# EAGLE design design (EAGLE 7.3.0)
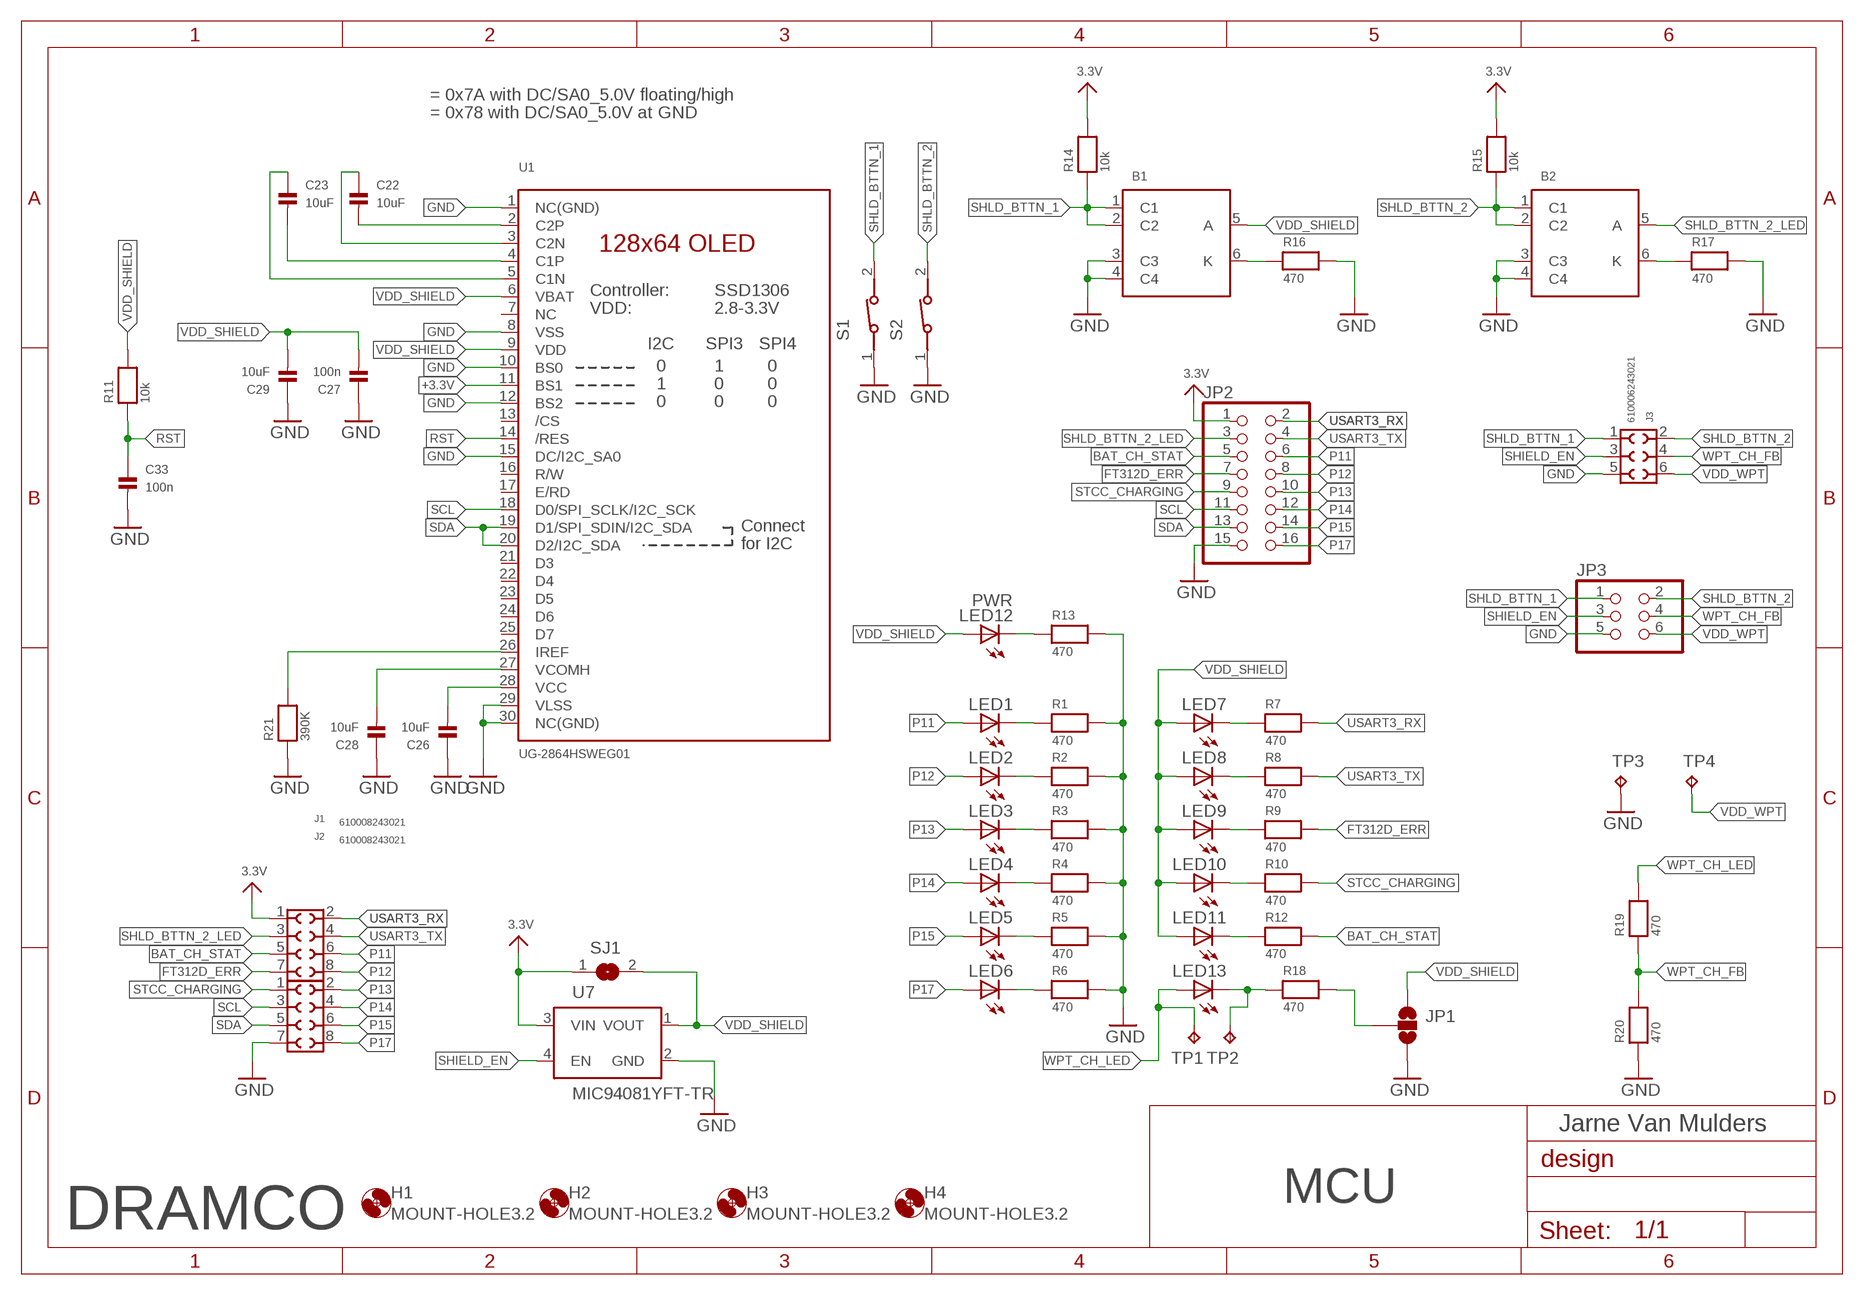
[diagram p0: schematic, sheet 1]

## Parts
B1  TS121273  [TS121273]
B2  TS121273  [TS121273]
C22  10uF  CAP_CERAMIC0805  [0805]
C23  10uF  CAP_CERAMIC0805  [0805]
C26  10uF  CAP_CERAMIC0805  [0805]
C27  100n  CAP_CERAMIC0603  [0603]
C28  10uF  CAP_CERAMIC0805  [0805]
C29  10uF  CAP_CERAMIC0805  [0805]
C33  100n  CAP_CERAMIC0603  [0603]
H1  MOUNT-HOLE3.2  [3,2]
H2  MOUNT-HOLE3.2  [3,2]
H3  MOUNT-HOLE3.2  [3,2]
H4  MOUNT-HOLE3.2  [3,2]
J1  610008243021  6100XX243021_610008243021  [610008243021]
J2  610008243021  6100XX243021_610008243021  [610008243021]
J3  610006243021  6100XX243021_610006243021  [610006243021]
JP1  JUMPER-SMT_3_NO_NO-SILK  [SMT-JUMPER_3_NO_NO-SILK]
JP2  HEADER-2X8  [2X08]
JP3  HEADER-2X3  [2X03_ROUND_70MIL]
LED1  LED3MM  [LED3MM]
LED2  LED3MM  [LED3MM]
LED3  LED3MM  [LED3MM]
LED4  LED3MM  [LED3MM]
LED5  LED3MM  [LED3MM]
LED6  LED3MM  [LED3MM]
LED7  LED3MM  [LED3MM]
LED8  LED3MM  [LED3MM]
LED9  LED3MM  [LED3MM]
LED10  LED3MM  [LED3MM]
LED11  LED3MM  [LED3MM]
LED12  PWR  LED3MM  [LED3MM]
LED13  LED3MM  [LED3MM]
R1  470  RESISTOR0603  [0603]
R2  470  RESISTOR0603  [0603]
R3  470  RESISTOR0603  [0603]
R4  470  RESISTOR0603  [0603]
R5  470  RESISTOR0603  [0603]
R6  470  RESISTOR0603  [0603]
R7  470  RESISTOR0603  [0603]
R8  470  RESISTOR0603  [0603]
R9  470  RESISTOR0603  [0603]
R10  470  RESISTOR0603  [0603]
R11  10k  RESISTOR0805  [0805]
R12  470  RESISTOR0603  [0603]
R13  470  RESISTOR0603  [0603]
R14  10k  RESISTOR0603  [0603]
R15  10k  RESISTOR0603  [0603]
R16  470  RESISTOR0603  [0603]
R17  470  RESISTOR0603  [0603]
R18  470  RESISTOR0603  [0603]
R19  470  RESISTOR0603  [0603]
R20  470  RESISTOR0603  [0603]
R21  390K  RESISTOR0805  [0805]
S1  434111043826  [434111043826]
S2  434111043826  [434111043826]
SJ1  SOLDERJUMPERREFLOW  [SOLDERJUMPER_REFLOW]
TP1  TPTP20SQ  [TP20SQ]
TP2  TPTP20SQ  [TP20SQ]
TP3  TPTP20SQ  [TP20SQ]
TP4  TPTP20SQ  [TP20SQ]
U1  UG-2864HSWEG01  DISP_OLED_UG-2864HSWEG010.96"  [UG-2864HSWEG01_0.96IN_WRAPAROUND]
U7  MIC94081YFT-TR  [IC_MIC94081YFT-TR]

## Nets
3.3V: J2.1 JP2.1 R14.2 R15.2 SJ1.1 U7.3(VIN)
+3.3V: U1.11(BS1)
BAT_CH_STAT: J2.5 JP2.5 R12.2
FT312D_ERR: J2.7 JP2.7 R9.2
GND: B1.3(C3) B1.4(C4) B2.3(C3) B2.4(C4) C26.1 C27.1 C28.1 C29.1 C33.2 J1.7 J3.5 JP1.3 JP2.15 JP3.5 R1.2 R2.2 R3.2 R4.2 R5.2 R6.2 R13.2 R16.2 R17.2 R20.1 R21.1 S1.1 S2.1 TP3.TP U1.1(NC(GND)) U1.8(VSS) U1.10(BS0) U1.12(BS2) U1.15(DC/I2C_SA0) U1.29(VLSS) U1.30(NC(GND)) U7.2(GND)
N$1: LED6.K(C) R6.1
N$3: LED5.K(C) R5.1
N$4: LED4.K(C) R4.1
N$5: LED3.K(C) R3.1
N$6: LED2.K(C) R2.1
N$7: LED1.K(C) R1.1
N$8: LED7.K(C) R7.1
N$9: LED8.K(C) R8.1
N$10: LED9.K(C) R9.1
N$11: C22.2 U1.2(C2P)
N$12: LED10.K(C) R10.1
N$13: LED11.K(C) R12.1
N$14: LED12.K(C) R13.1
N$15: B1.6(K) R16.1
N$16: C26.2 U1.28(VCC)
N$17: B2.6(K) R17.1
N$18: JP1.2 R18.2
N$19: C28.2 U1.27(VCOMH)
N$20: LED13.K(C) R18.1 TP2.TP
N$104: R21.2 U1.26(IREF)
N$112: C22.1 U1.3(C2N)
N$113: C23.2 U1.4(C1P)
N$114: C23.1 U1.5(C1N)
P11: J2.6 JP2.6 LED1.A
P12: J2.8 JP2.8 LED2.A
P13: J1.2 JP2.10 LED3.A
P14: J1.4 JP2.12 LED4.A
P15: J1.6 JP2.14 LED5.A
P17: J1.8 JP2.16 LED6.A
RST: C33.1 R11.1 U1.14(/RES)
SCL: J1.3 JP2.11 U1.18(D0/SPI_SCLK/I2C_SCK)
SDA: J1.5 JP2.13 U1.19(D1/SPI_SDIN/I2C_SDA) U1.20(D2/I2C_SDA)
SHIELD_EN: J3.3 JP3.3 U7.4(EN)
SHLD_BTTN_1: B1.1(C1) B1.2(C2) J3.1 JP3.1 R14.1 S1.2
SHLD_BTTN_2: B2.1(C1) B2.2(C2) J3.2 JP3.2 R15.1 S2.2
SHLD_BTTN_2_LED: B2.5(A) J2.3 JP2.3
STCC_CHARGING: J1.1 JP2.9 R10.2
USART3_RX: J2.2 JP2.2 R7.2
USART3_TX: J2.4 JP2.4 R8.2
VDD_SHIELD: B1.5(A) C27.2 C29.2 JP1.1 LED7.A LED8.A LED9.A LED10.A LED11.A LED12.A R11.2 SJ1.2 U1.6(VBAT) U1.9(VDD) U7.1(VOUT)
VDD_WPT: J3.6 JP3.6 TP4.TP
WPT_CH_FB: J3.4 JP3.4 R19.1 R20.2
WPT_CH_LED: LED13.A R19.2 TP1.TP
Unconnected: U1.7(NC) U1.13(/CS) U1.16(R/W) U1.17(E/RD) U1.21(D3) U1.22(D4) U1.23(D5) U1.24(D6) U1.25(D7)

## Notes on the sheet
- = 0x7A with DC/SA0_5.0V floating/high
- = 0x78 with DC/SA0_5.0V at GND
- Jarne Van Mulders
- MCU
- DRAMCO

## Library data of the parts
B1 B2 = TS121273:TS121273
C22 C23 C26-C29 C33 = microbuilder:CAP_CERAMIC: Ceramic Capacitors 0402 - 0402 Surface Mount Capacitors 16pF 50V 5% [Digikey: 445-4899-2-ND] 18pF 50V 5% [Digikey: 490-1281-2-ND] 22pF 50V 5% [Digikey: 490-1283-2-ND] 68pF 50V 5% [Digikey: 490-1289-2-ND] 0.1uF 10V 10% [Digikey: 490-1318-2-ND] 1.0uF 6.3V 10% [Digikey: 490-1320-2-ND] 0603 - 0603 Surface Mount Capacitors 16 pF 50V 5% [Digikey: 445-5051-2-ND] 22 pF 50V [Digikey: PCC220ACVTR-ND] 33 pF 50V 5% [Digikey: 490-1415-1-ND] 56pF 50V 5% [Digikey: 490-1421-1-ND] 220pF 50V 5% [Digikey: 445-1285-1-ND] 680 pF 50V 2200 pF 50V 5% C0G [Digikey: 445-1297-1-ND] 5600 pF 100V 5% X7R [Digikey: 478-3711-1-ND] 0.1 µF 25V 10% [Digikey: PCC2277TR-ND] 0.22 µF 16V 10% X7R [Digikey: 445-1318-1-ND] 1.0 µF 25V 10% [Digikey: 445-5146-2-ND] 0603 - RF Specific 3pF 250V +/-0.1pF RF [Digikey: 712-1347-1-ND] 18 pF 250V 5% [Digikey: 478-3505-1-ND or 712-1322-1-ND] 56 pF 250V 5% C0G RF [Digikey: 490-4867-1-ND] 68 pF 250V RF [Digikey: 490-4868-1-ND] 0805 - 0805 Surface Mount Capacitors 220 pF 250V 2% RF Ceramic Capacitor [Digikey: 712-1398-1-ND] 1000 pF 50V 2% NP0 Ceramic Capacitor [Digikey: 478-3760-1-ND] 0.1 µF 25V 10% Ceramic Capacitor [Digikey: PCC1828TR-ND] 1.0 µF 16V 10% Ceramic Capacitor[Digikey: 490-1691-2-ND] 10.0 µF 10V 10% Ceramic Capacitor[Digikey: 709-1228-1-ND] 10.0 uF 16V 10% Ceramic Capacitor [Digikey: 478-5165-2-ND] 47 uF 6.3V 20% Ceramic Capacitor [Digikey: 587-1779-1-ND or 399-5506-1-ND] 1206 - 1206 Surface Mount Capacitors 47uF 10V 20% Ceramic Capacitor [Digikey: 490-5528-1-ND or 399-5508-1-ND or 445-6010-1-ND] 100uF 6.3V -20%, +80% Y5V Ceramic Capacitor (Digikey: 490-4512-1-ND, Mouser: 81-GRM31CF50J107ZE1L)
H1-H4 = holes:MOUNT-HOLE: MOUNTING HOLE with drill center marker
J1 J2 = WR-PHD_Rev21a:6100XX243021_610008243021: WR-PHD 2.54 mm SMT Dual Socket Header Bottom Entry ARTICLE PROPERTIES: Pins:4;​ 6;​ 8;​ 10;​ 12;​ 16;​ 18;​ 20;​ 22;​ 24;​ 26;​ 32;​ 34 KIND PROPERTIES: Pitch：2.54 mm Quality Class:3 as per CECC 75 301-802 Rows：Dual Gender：Socket Header Type：Bottom Entry Large MATERIAL PROPERTIES: Insulator Material :PA6T Insulator Flammability Rating:UL94 V-0 Contact Material:Copper Alloy Contact Plating:Gold Contact Type:Stamped GENERAL INFORMATION Operating Temperature:-40 up to +125 °C Compliance:Lead free / RoHS ELECTRICAL PROPERTIES: Rated Current:3 A IR 1:3 A Withstanding Voltage:500 V (AC) Contact Resistance:20 mΩ RISO:1000 MΩ CERTIFICATION UL Approval:E323964 PACKAGING PROPERTIES Packaging:Tube <https://katalog.we-online.com/media/images/v2/o33207v209%20Family_WR-PHD_610xxx243021.jpg> Details see: https://katalog.we-online.com/en/em/PHD_2_54_SMT_DUAL_SOCKET_HEADER_BOTTOM_ENTRY_6100XX243021 Updated by Yingchun,Shan 2019-10-23 2019 (C) Würth Elektronik; DATASHEET-URL: https://www.we-online.com/catalog/datasheet/610008243021.pdf; GENDER: Socket Header; IR: 3A; MOUNT: SMT; PACKAGING: Tube; PART-NUMBER: 610008243021; PINS: 8; PITCH: 2.54mm; ROWS: Dual; TYPE: Bottom Entry Large
J3 = WR-PHD_Rev21a:6100XX243021_610006243021: WR-PHD 2.54 mm SMT Dual Socket Header Bottom Entry ARTICLE PROPERTIES: Pins:4;​ 6;​ 8;​ 10;​ 12;​ 16;​ 18;​ 20;​ 22;​ 24;​ 26;​ 32;​ 34 KIND PROPERTIES: Pitch：2.54 mm Quality Class:3 as per CECC 75 301-802 Rows：Dual Gender：Socket Header Type：Bottom Entry Large MATERIAL PROPERTIES: Insulator Material :PA6T Insulator Flammability Rating:UL94 V-0 Contact Material:Copper Alloy Contact Plating:Gold Contact Type:Stamped GENERAL INFORMATION Operating Temperature:-40 up to +125 °C Compliance:Lead free / RoHS ELECTRICAL PROPERTIES: Rated Current:3 A IR 1:3 A Withstanding Voltage:500 V (AC) Contact Resistance:20 mΩ RISO:1000 MΩ CERTIFICATION UL Approval:E323964 PACKAGING PROPERTIES Packaging:Tube <https://katalog.we-online.com/media/images/v2/o33207v209%20Family_WR-PHD_610xxx243021.jpg> Details see: https://katalog.we-online.com/en/em/PHD_2_54_SMT_DUAL_SOCKET_HEADER_BOTTOM_ENTRY_6100XX243021 Updated by Yingchun,Shan 2019-10-23 2019 (C) Würth Elektronik; DATASHEET-URL: https://www.we-online.com/catalog/datasheet/610006243021.pdf; GENDER: Socket Header; IR: 3A; MOUNT: SMT; PACKAGING: Tube; PART-NUMBER: 610006243021; PINS: 6; PITCH: 2.54mm; ROWS: Dual; TYPE: Bottom Entry Large
JP1 = SparkFun-Jumpers:JUMPER-SMT_3_NO: Normally open jumper This jumper has three pads in close proximity to each other. Apply solder to close the connection(s).
JP2 = microbuilder:HEADER-2X8
JP3 = microbuilder:HEADER-2X3: PIN HEADER
LED1-LED13 = adafruit:LED: LED OSRAM: - CHIPLED LG R971, LG N971, LY N971, LG Q971, LY Q971, LO R971, LY R971 LH N974, LH R974 LS Q976, LO Q976, LY Q976 LO Q996 - Hyper CHIPLED LW Q18S LB Q993, LB Q99A, LB R99A - SideLED LS A670, LO A670, LY A670, LG A670, LP A670 LB A673, LV A673, LT A673, LW A673 LH A674 LY A675 LS A676, LA A676, LO A676, LY A676, LW A676 LS A679, LY A679, LG A679 - Hyper Micro SIDELED® LS Y876, LA Y876, LO Y876, LY Y876 LT Y87S - SmartLED LW L88C, LW L88S LB L89C, LB L89S, LG L890 LS L89K, LO L89K, LY L89K LS L896, LA L896, LO L896, LY L896 - TOPLED LS T670, LO T670, LY T670, LG T670, LP T670 LSG T670, LSP T670, LSY T670, LOP T670, LYG T670 LG T671, LOG T671, LSG T671 LB T673, LV T673, LT T673, LW T673 LH T674 LS T676, LA T676, LO T676, LY T676, LB T676, LH T676, LSB T676, LW T676 LB T67C, LV T67C, LT T67C, LS T67K, LO T67K, LY T67K, LW E67C LS E67B, LA E67B, LO E67B, LY E67B, LB E67C, LV E67C, LT E67C LW T67C LS T679, LY T679, LG T679 LS T770, LO T770, LY T770, LG T770, LP T770 LB T773, LV T773, LT T773, LW T773 LH T774 LS E675, LA E675, LY E675, LS T675 LS T776, LA T776, LO T776, LY T776, LB T776 LHGB T686 LT T68C, LB T68C - Hyper Mini TOPLED® LB M676 - Mini TOPLED Santana® LG M470 LS M47K, LO M47K, LY M47K Source: http://www.osram.convergy.de/
R1-R21 = microbuilder:RESISTOR: Resistors 0402 - 0402 Surface Mount Package 22 Ohm 1% 1/16W [Digikey: 311-22.0LRTR-ND] 33 Ohm 5% 1/16W 1.0K 5% 1/16W 1.5K 5% 1/16W 2.0K 1% 1/16W 10.0K 1% 1/16W [Digikey: 311-10.0KLRTR-ND] 10.0K 5% 1/16W [Digikey: RMCF0402JT10K0TR-ND] 12.1K 1% 1/16W [Digikey: 311-22.0LRTR-ND] 100.0K 5% 1/16W 0603 - 0603 Surface Mount Package 0 Ohm 1/10 Watt 1% Resistor 15 Ohm 1/10 Watt 1% Resistor 33 Ohm 1/10 Watt 1% Resistor 49.9 Ohm 1/10 Watt 1% Resistor 100 Ohm 1/10 Watt 1% Resistor 150 Ohm 1/10 Watt 1% Resistor 240 Ohm 1/10 Watt 1% Resistor 390 Ohm 1/10 Watt 1% Resistor 560 Ohm 1/10 Watt 1% Resistor 680 Ohm 1/10 Watt 1% Resistor 750 Ohm 1/10 Watt 1% Resistor 1.0K Ohm 1/10 Watt 1% Resistor 1.5K Ohm 1/10 Watt 1% Resistor 2.0K Ohm 1/10 Watt 1% Resistor 2.2K Ohm 1/10 Watt 1% Resistor 3.3K Ohm 1/10 Watt 1% Resistor 4.7K Ohm 1/10 Watt 1% Resistor 10.0K Ohm 1/10 Watt 1% Resistor 12.0K Ohm 1/10 Watt 1% Resistor 12.1K Ohm 1/10 Watt 1% Resistor 20.0K Ohm 1/10 Watt 1% Resistor 33.0K Ohm 1/10 Watt 1% Resistor 100.0K Ohm 1/10 Watt 1% Resistor 0805 - 0805 Surface Mount Package 0 Ohm 1/8 Watt 1% Resistor 33 Ohm 1/8 Watt 1% Resistor 100 Ohm 1/8 Watt 1% Resistor 150 Ohm 1/8 Watt 1% Resistor 200 Ohm 1/8 Watt 1% Resistor 240 Ohm 1/8 Watt 1% Resistor 330 Ohm 1/8 Watt 1% Resistor 390 Ohm 1/8 Watt 1% Resistor 470 Ohm 1/8 Watt 1% Resistor 1.0K Ohm 1/8 Watt 1% Resistor 1.5K Ohm 1/8 Watt 1% Resistor 2.0K Ohm 1/8 Watt 1% Resistor 4.7K Ohm 1/8 Watt 1% Resistor 5.1K Ohm 1/8 Watt 1% Resistor 5.6K Ohm 1/8 Watt 1% Resistor 10.0K Ohm 1/8 Watt 1% Resistor 22.0K Ohm 1/8 Watt 1% Resistor 33.0K Ohm 1/8 Watt 1% Resistor 100K Ohm 1/8 Watt 1% Resistor 1206 - 1206 Surface Mount Package 2012 - 2010 Surface Mount Package 0.11 Ohm 1/2 Watt 1% Resistor - Digikey: RHM.11UCT-ND
S1 S2 = Eagle_SWITCHES (rev18c):434111043826: 6.0x3.5 mm SMD WS-TASV <http://katalog.we-online.de/media/images/v2/Family_WS-TASV_6.0x3.jpg> Details see: http://katalog.we-online.de/em/datasheet/4341x1xxx8x6.pdf 2015 (C) Wurth Elektronik
SJ1 = microbuilder:SOLDERJUMPER: SMD Solder JUMPER Solder the two pads together to create a connection, or remove the solder to break it. REFLOW - Use this footprint for solder paste and reflow ovens. WAVE - Use this footprint for hand-soldering (larger pads). CLOSED - Has a trace between the two pads to ensure it is closed by default. The trace needs to be cut to disable the jumper, and can be closed again by creating a solder bridge between the two pads.
TP1-TP4 = testpad:TP: Test pad
U1 = microbuilder:DISP_OLED_UG-2864HSWEG01: UG-2864HSWEG01 OLED display Both 1.3" and 0.96" models share the same FPC tab footprint, only the screen dimensions vary.
U7 = MIC94081YFT-TR:MIC94081YFT-TR: Power Switch/Driver 1:1 P-Channel 2A 4-TMLF® (0.85x0.85) Check prices <https://pricing.snapeda.com/parts/MIC94081YFT-TR/Microchip/view-part?ref=eda>; AVAILABILITY: In Stock; DESCRIPTION: Power Switch/Driver 1:1 P-Channel 2A 4-TMLF® (0.85x0.85); MF: Microchip; MP: MIC94081YFT-TR; PACKAGE: UFDFN-4 Microchip; PRICE: None

## Board
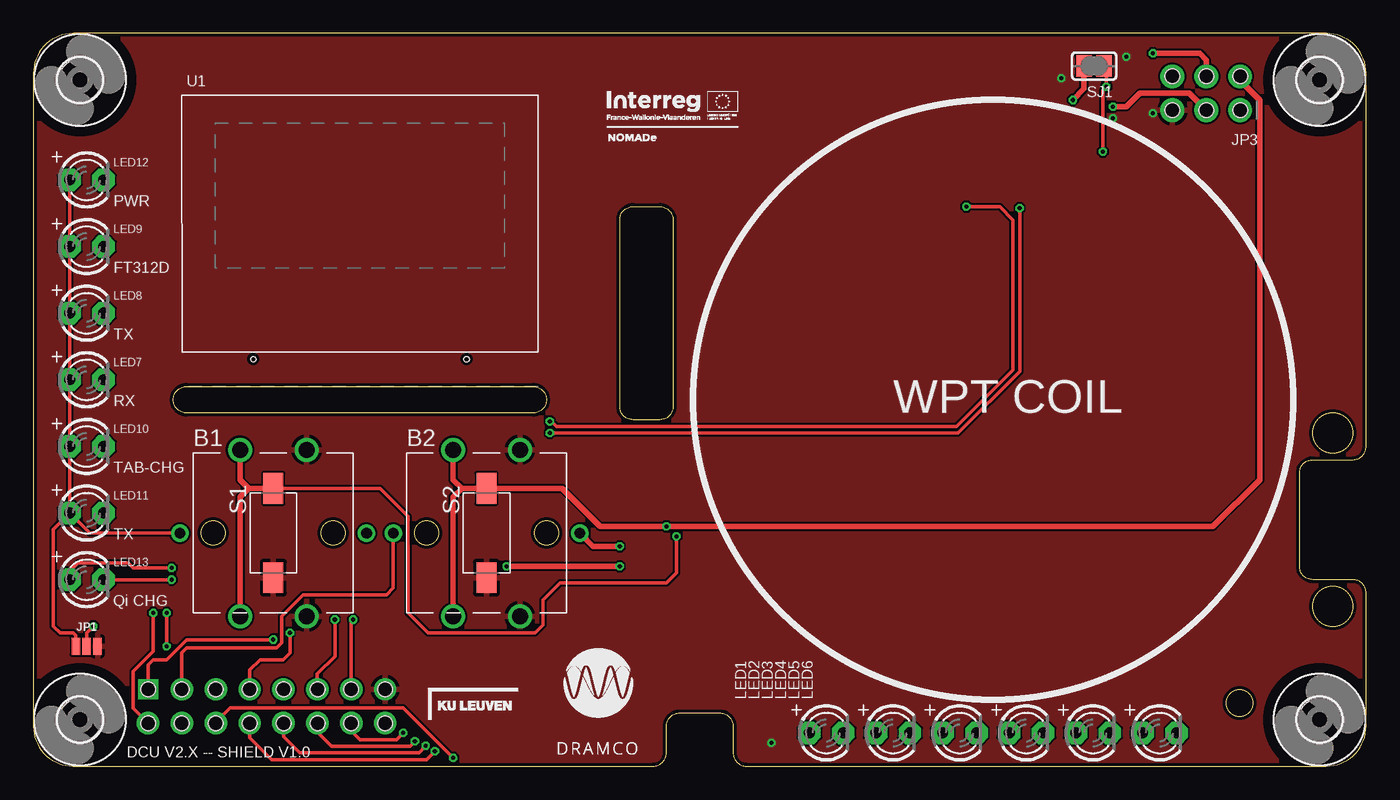
[diagram p1: board, top side]
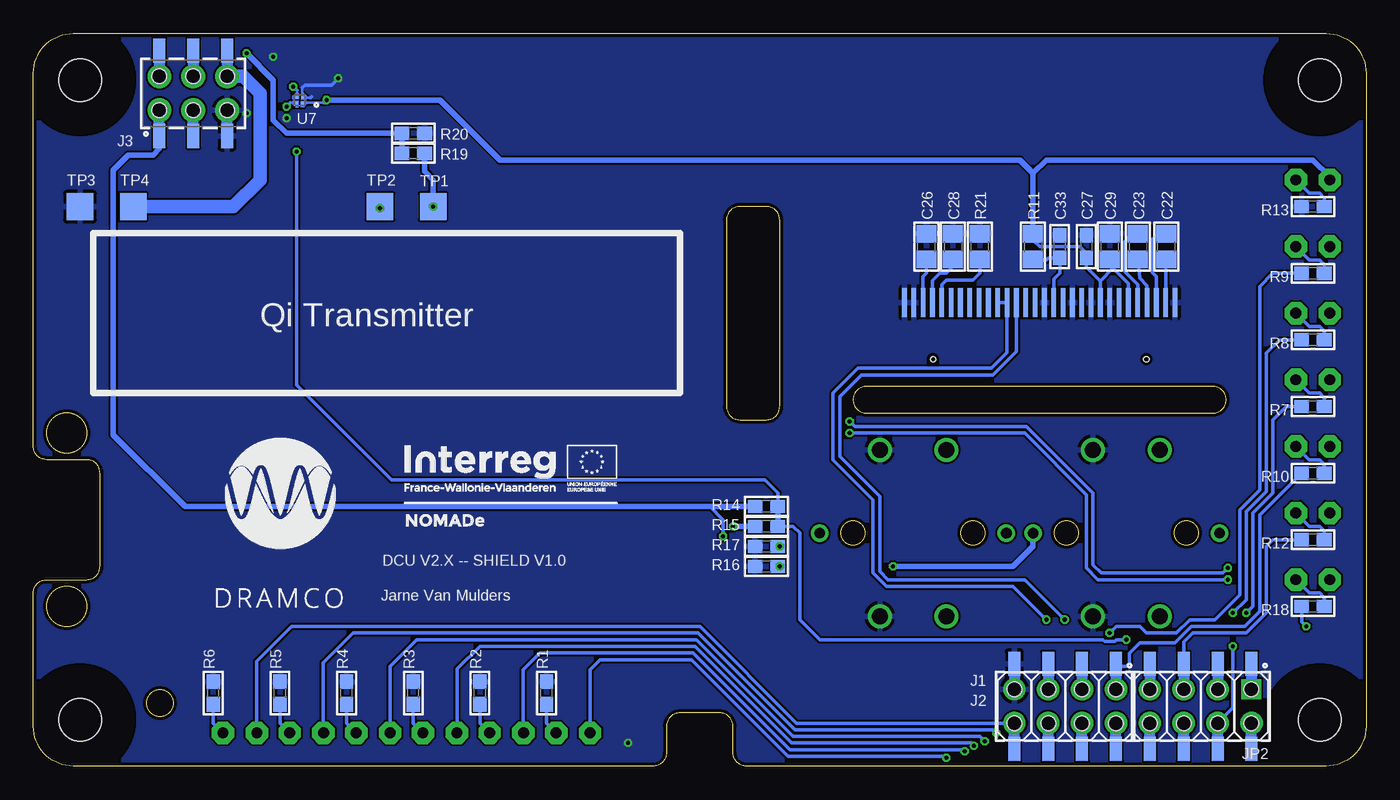
[diagram p2: board, bottom side, seen from below]

Size 100 x 55 mm. Coordinates in mm from the lower left corner, seen from the top.
Outline: 0,52 0,3 arc90 3,0 46.5,0 arc90 47.5,1 47.5,3 arc-90 48.5,4 51.5,4 arc-90 52.5,3 52.5,1 arc90 53.5,0 97,0 arc90 100,3 100,13 arc90 99,14 96,14 arc-90 95,15 95,22 arc-90 96,23 99,23 arc90 100,24 100,52 arc90 97,55 3,55 arc90 0,52
Outline: 11.5,28.5 37.5,28.5 arc-90 38.5,27.5 arc-90 37.5,26.5 11.5,26.5 arc-90 10.5,27.5 arc-90 11.5,28.5
Outline: 48,41 48,27 arc-90 47,26 45,26 arc-90 44,27 44,41 arc-90 45,42 47,42 arc-90 48,41
Outline: circle at 90.5,4.75 radius 1
Outline: circle at 97.5,12 radius 1.5
Outline: circle at 97.5,25 radius 1.5
Copper layers (1*16): Top 0.035mm / dielectric 1.5mm / Bottom 0.035mm
Design rules "SeeedStudio_2layer_DRU_no_angle_20140221-2": minimum track width 6mil, minimum drill 12mil, track to track 6mil, track to pad 6mil, pad to pad 6mil, via to via 6mil, smd to smd 0mil, copper to edge 10mil, drill to drill 10mil, minimum pad ring 10mil, minimum via ring 6mil, stop-mask expansion 2mil, vias tented up to drill 100mil, thermal gap 10mil

### Footprints (pad centres in the part's own frame; a part is rotated, then mirrored left to right if it is on the bottom)
TS121273 = drill 1.2: 1 -6.25,2.5; 2 6.25,2.5; 3 -6.25,-2.5; 4 6.25,-2.5 | drill 0.8: 5 0,7; 6 0,-7
0805 = smd 1.3 x 1.5: 1 -0.95,0; 2 0.95,0
0603 = smd 1.1 x 1: 1 -0.85,0; 2 0.85,0
3,2 = hole 3.2: 0,0
610008243021 = smd 0.9 x 1.8: 1 -3.81,-3.2; 2 -3.81,3.2; 3 -1.27,-3.2; 4 -1.27,3.2; 5 1.27,-3.2; 6 1.27,3.2; 7 3.81,-3.2; 8 3.81,3.2 | hole 1.1: -3.81,1.27; -1.27,1.27; -1.27,-1.27; -3.81,-1.27; 1.27,1.27; 1.27,-1.27; 3.81,1.27; 3.81,-1.27
610006243021 = smd 0.9 x 1.8: 1 -2.54,-3.2; 2 -2.54,3.2; 3 0,-3.2; 4 0,3.2; 5 2.54,-3.2; 6 2.54,3.2 | hole 1.1: -2.54,1.27; 0,1.27; 0,-1.27; -2.54,-1.27; 2.54,1.27; 2.54,-1.27
SMT-JUMPER_3_NO_NO-SILK = smd 0.635 x 1.27: 1 -0.813,0; 2 0,0; 3 0.813,0
2X08 = drill 1 square: 1 -8.89,-1.27 | drill 1 pad 1.676: 2 -8.89,1.27; 3 -6.35,-1.27; 4 -6.35,1.27; 5 -3.81,-1.27; 6 -3.81,1.27; 7 -1.27,-1.27; 8 -1.27,1.27; 9 1.27,-1.27; 10 1.27,1.27; 11 3.81,-1.27; 12 3.81,1.27; 13 6.35,-1.27; 14 6.35,1.27; 15 8.89,-1.27; 16 8.89,1.27
2X03_ROUND_70MIL = drill 1 pad 1.778: 1 -2.54,1.27; 2 -2.54,-1.27; 3 0,1.27; 4 0,-1.27; 5 2.54,1.27; 6 2.54,-1.27
LED3MM = drill 0.813 pad 1.676 octagon: A -1.27,0; K 1.27,0
434111043826 = smd 2.3 x 1.5: 1 -3.35,0; 2 3.35,0
SOLDERJUMPER_REFLOW = smd 1.168 x 1.6: 1 -0.762,0; 2 0.762,0
TP20SQ = smd 2 x 2: TP 0,0
UG-2864HSWEG01_0.96IN_WRAPAROUND = smd 0.35 x 2.2 bottom: 1 -10.15,-1.2; 2 -9.45,-1.2; 3 -8.75,-1.2; 4 -8.05,-1.2; 5 -7.35,-1.2; 6 -6.65,-1.2; 7 -5.95,-1.2; 8 -5.25,-1.2; 9 -4.55,-1.2; 10 -3.85,-1.2; 11 -3.15,-1.2; 12 -2.45,-1.2; 13 -1.75,-1.2; 14 -1.05,-1.2; 15 -0.35,-1.2; 16 0.35,-1.2; 17 1.05,-1.2; 18 1.75,-1.2; 19 2.45,-1.2; 20 3.15,-1.2; 21 3.85,-1.2; 22 4.55,-1.2; 23 5.25,-1.2; 24 5.95,-1.2; 25 6.65,-1.2; 26 7.35,-1.2; 27 8.05,-1.2; 28 8.75,-1.2; 29 9.45,-1.2; 30 10.15,-1.2 | hole 0.4: -8,-5.45; 8,-5.45
IC_MIC94081YFT-TR = smd 0.2 x 0.2: 1 -0.2,0.2; 2 -0.2,-0.2; 3 0.2,-0.2; 4 0.2,0.2

### Placement (x,y rotation side)
B1  18,17.5 90 top
B2  34,17.5 90 top
C22  15,39 270 bottom
C23  17.12,39 270 bottom
C26  33,39 270 bottom
C27  21,39 270 bottom
C28  31,39 270 bottom
C29  19.25,39 270 bottom
C33  23,39 90 bottom
H1  3.5,3.5 0 top
H2  3.5,51.5 0 top
H3  96.5,51.5 0 top
H4  96.5,3.5 0 top
J1  22.59,4.5 180 bottom
J2  12.41,4.5 180 bottom
J3  88,50.5 0 bottom
JP1  4,9 0 top
JP2  17.5,4.5 180 bottom
JP3  88,50.5 180 top
LED1  59.5,2.5 0 top
LED2  64.5,2.5 0 top
LED3  69.5,2.5 0 top
LED4  74.5,2.5 0 top
LED5  79.5,2.5 0 top
LED6  84.5,2.5 0 top
LED7  4,29 0 top
LED8  4,34 0 top
LED9  4,39 0 top
LED10  4,24 0 top
LED11  4,19 0 top
LED12  4,44 0 top
LED13  4,14 0 top
R1  61.5,5.5 90 bottom
R2  66.5,5.5 90 bottom
R3  71.5,5.5 90 bottom
R4  76.5,5.5 90 bottom
R5  81.5,5.5 90 bottom
R6  86.5,5.5 90 bottom
R7  4,27 180 bottom
R8  4,32 180 bottom
R9  4,37 180 bottom
R10  4,22 180 bottom
R11  25,39 90 bottom
R12  4,17 180 bottom
R13  4,42 180 bottom
R14  45,19.5 0 bottom
R15  45,18 0 bottom
R16  45,15 180 bottom
R17  45,16.5 180 bottom
R18  4,12 180 bottom
R19  71.5,46 0 bottom
R20  71.5,47.5 180 bottom
R21  29,39 270 bottom
S1  18,17.5 90 top
S2  34,17.5 90 top
SJ1  79.59,52.55 180 top
TP1  70,42 0 bottom
TP2  74,42 0 bottom
TP3  96.5,42 0 bottom
TP4  92.5,42 0 bottom
U1  24.5,36 0 top
U7  80.02,49.98 180 bottom

### Tracks (layer width: path | path; a pad name or v marks a point on that pad's centre or on a via)
3.3V  (via drill 0.31)
  Top 0.254: v18,9.5 11.5,9.5 10,8 9,8 8.61,7.61 JP2.1 | SJ1.1 80.5,52.4 v80.5,51 80.25,50.75 v80.25,46.12
  Bottom 0.2: U7.3 80.22,50.72
  Bottom 0.254: v18,9.5 18.75,9.5 18.88,9.38 19.62,9.38 19.75,9.5 41,9.5 42.5,11 42.5,17.5 43,18 R15.2 | 80.22,50.72 v80.5,51 | R14.2 44.15,20.52 45.12,21.5 73.12,21.5 80.25,28.62 v80.25,46.12
  Bottom 0.406: R15.2 R14.2
  Bottom 0.813: J2.1 JP2.1
BAT_CH_STAT
  Bottom 0.254: R12.2 7,17 7.5,16.5 7.5,11.5 9,10 13,10 13.69,9.31 J2.5
  Bottom 0.813: J2.5 JP2.5
FT312D_ERR  (via drill 0.31)
  Top 0.254: v19.25,10 19.25,8.5 18.75,8 17,8 16.23,7.23 JP2.7
  Bottom 0.254: R9.2 7,37 8,36 8,20.75 9.5,19.25 9.5,12.88 11.38,11 13.25,11 14.25,10 16.5,10 17,10.5 18.75,10.5 v19.25,10
  Bottom 0.813: J2.7 JP2.7
GND  (via drill 0.31)
  Bottom 0.2: 79.19,50.18 U7.2 79.81,50.94
  Bottom 0.254: 79.19,50.18 79.12,50.25 | 79.81,50.94 79.62,51.12 77.62,51.12 v77.12,51.62
  Bottom 0.813: J3.5 JP3.5 | J1.7 JP2.15
  other vias: 55.38,1.75 82,53.25 84,49 81,48.62
  pour Bottom (isolate 0.152, rank 6): -17.94,76.2 129.06,76.2 129.06,-32.07 -17.94,-32.07
  pour Top (isolate 0.152, rank 6): -16.35,70.33 116.68,70.33 116.68,-16.03 -16.35,-16.03
N$1
  Bottom 0.254: R6.1 86.5,3.23 LED6.K
N$3
  Bottom 0.254: R5.1 81.5,3.23 LED5.K
N$4
  Bottom 0.254: R4.1 76.5,3.23 LED4.K
N$5
  Bottom 0.254: R3.1 71.5,3.23 LED3.K
N$6
  Bottom 0.254: R2.1 66.5,3.23 LED2.K
N$7
  Bottom 0.254: R1.1 61.5,3.23 LED1.K
N$8
  Bottom 0.254: R7.1 3.15,27.65 3.5,28 4.27,28 LED7.K
N$9
  Bottom 0.254: R8.1 3.15,32.65 3.5,33 4.27,33 LED8.K
N$10
  Bottom 0.254: R9.1 3.15,37.65 3.5,38 4.27,38 LED9.K
N$11
  Bottom 0.254: U1.2 15.05,38 C22.2
N$12
  Bottom 0.254: R10.1 3.15,22.65 3.5,23 4.27,23 LED10.K
N$13
  Bottom 0.254: R12.1 3.15,17.65 3.5,18 4.27,18 LED11.K
N$14
  Bottom 0.254: R13.1 3.15,42.65 3.5,43 4.27,43 LED12.K
N$15  (via drill 0.31)
  Top 0.406: v35.5,15 v44,15
  Bottom 0.406: v44,15 R16.1 | B1.6 25,16.5 26.5,15 v35.5,15
N$16
  Bottom 0.254: U1.28 33.25,36.75 33,37 C26.2
N$17  (via drill 0.31)
  Top 0.406: B2.6 42,16.5 v44,16.5
  Bottom 0.406: v44,16.5 R17.1
N$18  (via drill 0.31)
  Top 0.254: JP1.2 4,10 v4.5,10.5
  Bottom 0.254: R18.2 4.85,10.85 v4.5,10.5
N$19
  Bottom 0.254: U1.27 32.55,36.45 32,37 31.5,37 31,37.5 C28.2
N$20  (via drill 0.31)
  Top 0.254: LED13.K v10.38,14 | v38.75,25 69.38,25 74,29.62 v74,41.88
  Bottom 0.254: R18.1 3.15,12.65 3.5,13 4.27,13 LED13.K | v10.38,14 20.12,14 21,14.88 21,20.38 25.62,25 v38.75,25 | v74,41.88 TP2.TP
N$104
  Bottom 0.254: U1.26 31.85,36.15 31.5,36.5 29.5,36.5 29,37 R21.2
N$112
  Bottom 0.254: U1.3 15.75,36.75 16.06,37.06 16.06,39.56 15.5,40 15.05,40 C22.1
N$113
  Bottom 0.254: U1.4 16.45,36.08 17,36.62 C23.2
N$114
  Bottom 0.254: U1.5 17.15,36.15 18.19,37.19 18.19,39.31 17.5,40 17.05,40 C23.1
P11  (via drill 0.31)
  Top 0.254: JP2.6 13.69,3.31 14.75,4.38 27.75,4.38 v31.5,0.62
  Bottom 0.254: v31.5,0.62 31.62,0.62 31.75,0.75 43.38,0.75 50.62,8 57.5,8 58.25,7.25 58.25,2.52 LED1.A
  Bottom 0.813: J2.6 JP2.6
P12  (via drill 0.31)
  Top 0.254: JP2.8 16.23,2.15 17.88,0.5 29.5,0.5 v30.12,1.12
  Bottom 0.254: v30.12,1.12 30.25,1.25 43.25,1.25 50.5,8.5 62,8.5 63.25,7.25 63.25,2.6 LED2.A
  Bottom 0.813: J2.8 JP2.8
P13  (via drill 0.31)
  Top 0.254: JP2.10 18.77,2.22 19.97,1.02 28.93,1.02 v29.44,1.54
  Bottom 0.254: v29.44,1.54 29.62,1.75 43.12,1.75 50.38,9 66.5,9 68.22,7.3 LED3.A
  Bottom 0.813: J1.2 JP2.10
P14  (via drill 0.31)
  Top 0.254: JP2.12 21.31,2.56 22.38,1.5 28.25,1.5 v28.62,1.88
  Bottom 0.254: v28.62,1.88 29,2.25 43,2.25 50.25,9.5 71.25,9.5 73.25,7.5 73.25,2.52 LED4.A
  Bottom 0.813: J1.4 JP2.12
P15  (via drill 0.31)
  Top 0.254: JP2.14 23.85,2.65 24.5,2 27.25,2 v27.75,2.5
  Bottom 0.254: v27.75,2.5 28,2.75 42.88,2.75 50.12,10 76,10 78.25,7.75 78.25,2.52 LED5.A
  Bottom 0.813: J1.6 JP2.14
P17
  Bottom 0.254: JP2.16 42.73,3.23 50,10.5 80.62,10.5 83.25,7.88 83.25,2.52 LED6.A
  Bottom 0.813: J1.8 JP2.16
RST
  Bottom 0.254: U1.14 23.45,36.55 23,37 C33.1 23.85,38.15 24,38 24.95,38 R11.1
SCL  (via drill 0.31)
  Top 0.254: v22.62,11 22.62,8.25 21.31,6.93 JP2.11
  Bottom 0.254: U1.18 26.25,31.12 28,29.38 37.88,29.38 39.5,27.75 39.5,23.25 36.5,20.25 36.5,14.62 35.88,14 25.62,14 v22.62,11
  Bottom 0.813: J1.3 JP2.11
SDA  (via drill 0.31)
  Top 0.254: v24,11 23.85,10.85 JP2.13
  Bottom 0.254: U1.20 U1.19 26.95,31.05 28.12,29.88 38.12,29.88 40,28 40,23 37,20 37,14.5 36,13.5 26.5,13.5 v24,11
  Bottom 0.813: J1.5 JP2.13
SHIELD_EN  (via drill 0.31)
  Top 0.406: v81,49.5 82,49.5 83,50.5 86.73,50.5 JP3.3
  Bottom 0.2: U7.4 80.72,49.78
  Bottom 0.254: 80.72,49.78 v81,49.5
  Bottom 0.813: J3.3 JP3.3
SHLD_BTTN_1  (via drill 0.31)
  Top 0.254: S1.2 26.02,20.85 28.12,18.75 28.12,11.5 29.62,10 37.62,10 38.25,10.62 38.25,12.5 39.5,13.75 47.5,13.75 48.25,14.5 v48.25,17.25
  Top 0.406: S1.2 16.15,20.85 | 16.15,20.85 15.5,21.5 B1.2 | B1.1 15.5,20.2 16.15,20.85
  Bottom 0.254: v48.25,17.25 48.25,18.5 49.25,19.5
  Bottom 0.406: R14.1 49.25,19.5 88.62,19.5 94,24.88 94,44.75 92.88,45.88 91,45.88 90.54,46.34 J3.1
  Bottom 0.813: J3.1 JP3.1
SHLD_BTTN_2  (via drill 0.31)
  Top 0.406: JP3.2 90.54,51.46 92,50 92,21.5 88.5,18 v47.5,18 42.5,18 39.65,20.85 S2.2 32.15,20.85 | 32.15,20.85 31.5,21.5 B2.2 | B2.1 31.5,20.2 32.15,20.85
  Bottom 0.406: v47.5,18 R15.1
  Bottom 0.813: J3.2 JP3.2
SHLD_BTTN_2_LED
  Top 0.254: B2.5 27,13.38 26.5,12.88 20.25,12.88 18.62,11.25 18.62,9.25 18.25,8.88 11.5,8.88 11.12,8.5 11.12,5.79 JP2.3
  Bottom 0.813: J2.3 JP2.3
STCC_CHARGING
  Bottom 0.254: R10.2 8,18.85 8,11.62 9.12,10.5 13.12,10.5 14.38,9.25 17,9.25 17.77,8.47 17.77,7.72 18,7.5 18.57,7.5 J1.1
  Bottom 0.813: J1.1 JP2.9
USART3_RX  (via drill 0.31)
  Top 0.254: v9,11.5 9,8.62 7.5,7.12 7.5,4.34 JP2.2
  Bottom 0.254: R7.2 6,27 7,26 7,20.5 8.5,19 8.5,12 v9,11.5
  Bottom 0.813: J2.2 JP2.2
USART3_TX  (via drill 0.31)
  Top 0.254: v10,11.5 v10,9
  Bottom 0.254: R8.2 6.5,32 7.5,31 7.5,20.62 9,19.12 9,12.5 v10,11.5 | v10,9 10,4.38 JP2.4
  Bottom 0.813: J2.4 JP2.4
VDD_SHIELD  (via drill 0.31)
  Top 0.254: JP1.1 3.19,9.81 3,10 2,10 1.5,10.5 1.5,17.77 LED11.A | LED11.A LED10.A LED7.A LED8.A LED9.A LED12.A | B1.5 4.23,17.5 LED11.A
  Top 0.406: SJ1.2 78.83,50.83 v78,50
  Bottom 0.2: U7.1 78.22,49.78
  Bottom 0.254: U1.9 19.95,36.42 | 19.95,36.42 19,37.38 | 19,37.38 C29.2 | U1.6 17.85,36.23 19,37.38 | 19.95,36.42 21,37.48 C27.2 21,38.5 21.5,39 24.5,39 25,39.5 R11.2 | 78.22,49.78 v78,50
  Bottom 0.406: R11.2 25,44.5 | 25,44.5 24,45.5 4,45.5 2.73,44.23 LED12.A | 25,44.5 26,45.5 65,45.5 69.5,50 v78,50
VDD_WPT
  Bottom 0.813: J3.6 JP3.6
  Bottom 1.016: TP4.TP 85,42 83,44 83,50.5 84.27,51.77 JP3.6
WPT_CH_FB  (via drill 0.31)
  Top 0.406: v84,53.5 87.5,53.5 88,53 JP3.4
  Bottom 0.406: R19.1 R20.2 81,47.5 82,48.5 82,51.5 v84,53.5
  Bottom 0.813: J3.4 JP3.4
WPT_CH_LED  (via drill 0.31)
  Top 0.254: LED13.A 2.73,14.61 3.38,15.25 7.12,15.25 7.5,14.88 v10.38,14.88 | v38.75,25.88 38.88,25.88 39.25,25.5 69.25,25.5 73.5,29.75 73.5,41 72.5,42 TP1.TP
  Bottom 0.254: v10.38,14.88 10.75,14.5 19.88,14.5 20.5,15.12 20.5,20.5 25.5,25.5 38.38,25.5 v38.75,25.88
  Bottom 0.406: TP1.TP 70,44 70.65,44.65 R19.2
  other vias: 70,42

### Text on the board
tPlace: PWR | FT312D | TX | RX | WPT COIL | TAB-CHG | TX | Qi CHG | DCU V2.X -- SHIELD V1.0
bPlace: Qi Transmitter | DCU V2.X -- SHIELD V1.0 | Jarne Van Mulders
tNames: C:/Users/JarneVanMulders/Box/Werk/Templates/logo s/logo-text-black.bmp'